# Altium schematic sheet F800 Rear wire - Wire map.SchDoc
size A4; Organization: Altium Limited; Address1: L3, 12a Rodborough Rd; Address2: Frenchs Forest; Address3: NSW; Address4: Australia 2086
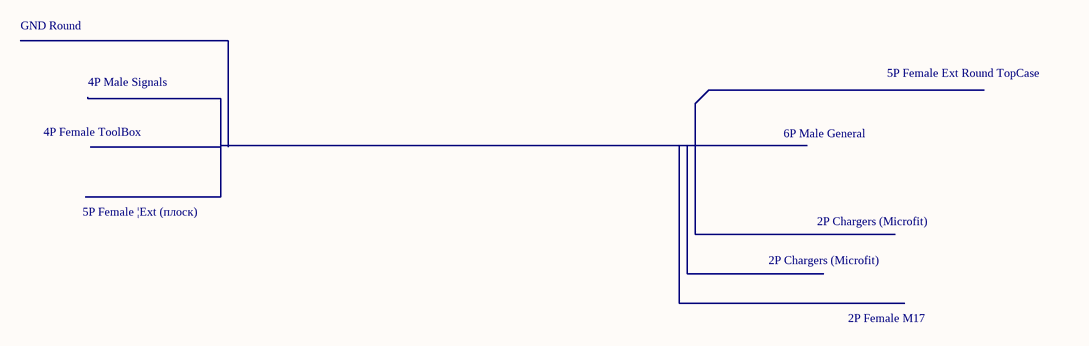
[diagram p0: F800 Rear wire - Wire map.SchDoc]

## Notes on the sheet
- GND Round
- 4P Male Signals
- 5P Female Ext Round TopCase
- 4P Female ToolBox
- 6P Male General
- 5P Female |Ext (плоск)
- 2P Chargers (Microfit)
- 2P Female M17
- Title
- Size:
- Date:
- A4
- Number:
- Time:
- Revision:
- Sheet
- of
- File: